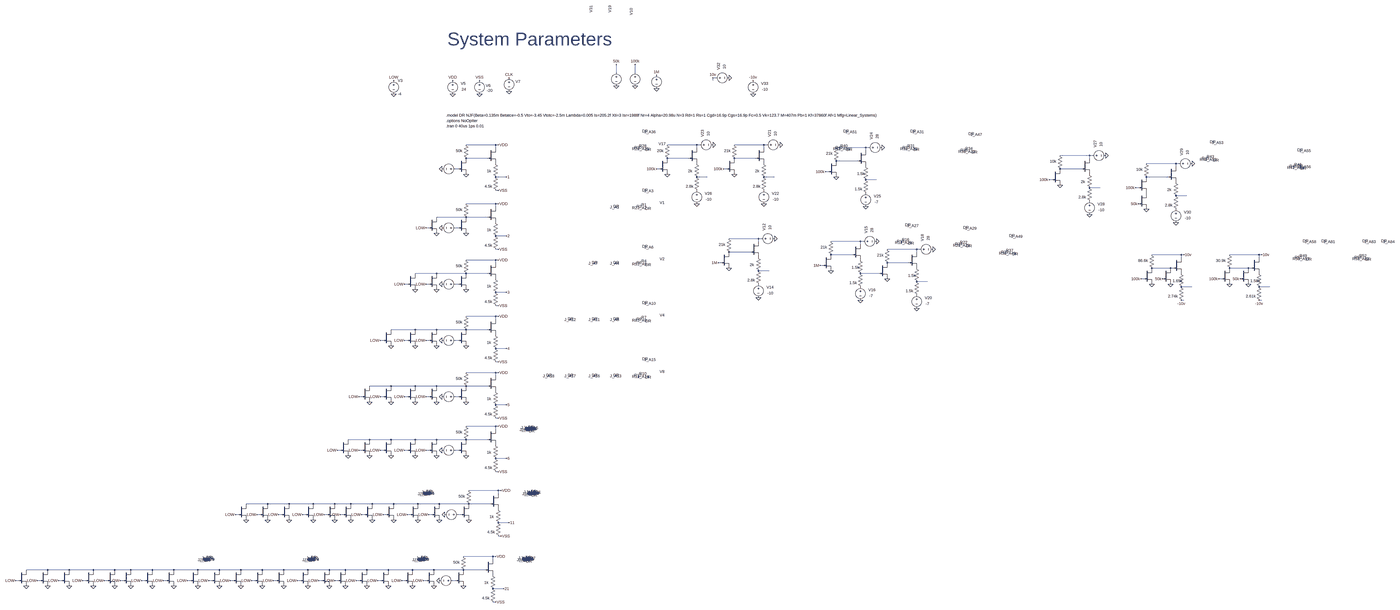
[diagram p0: schematic Multi-Or.asc, whole sheet]
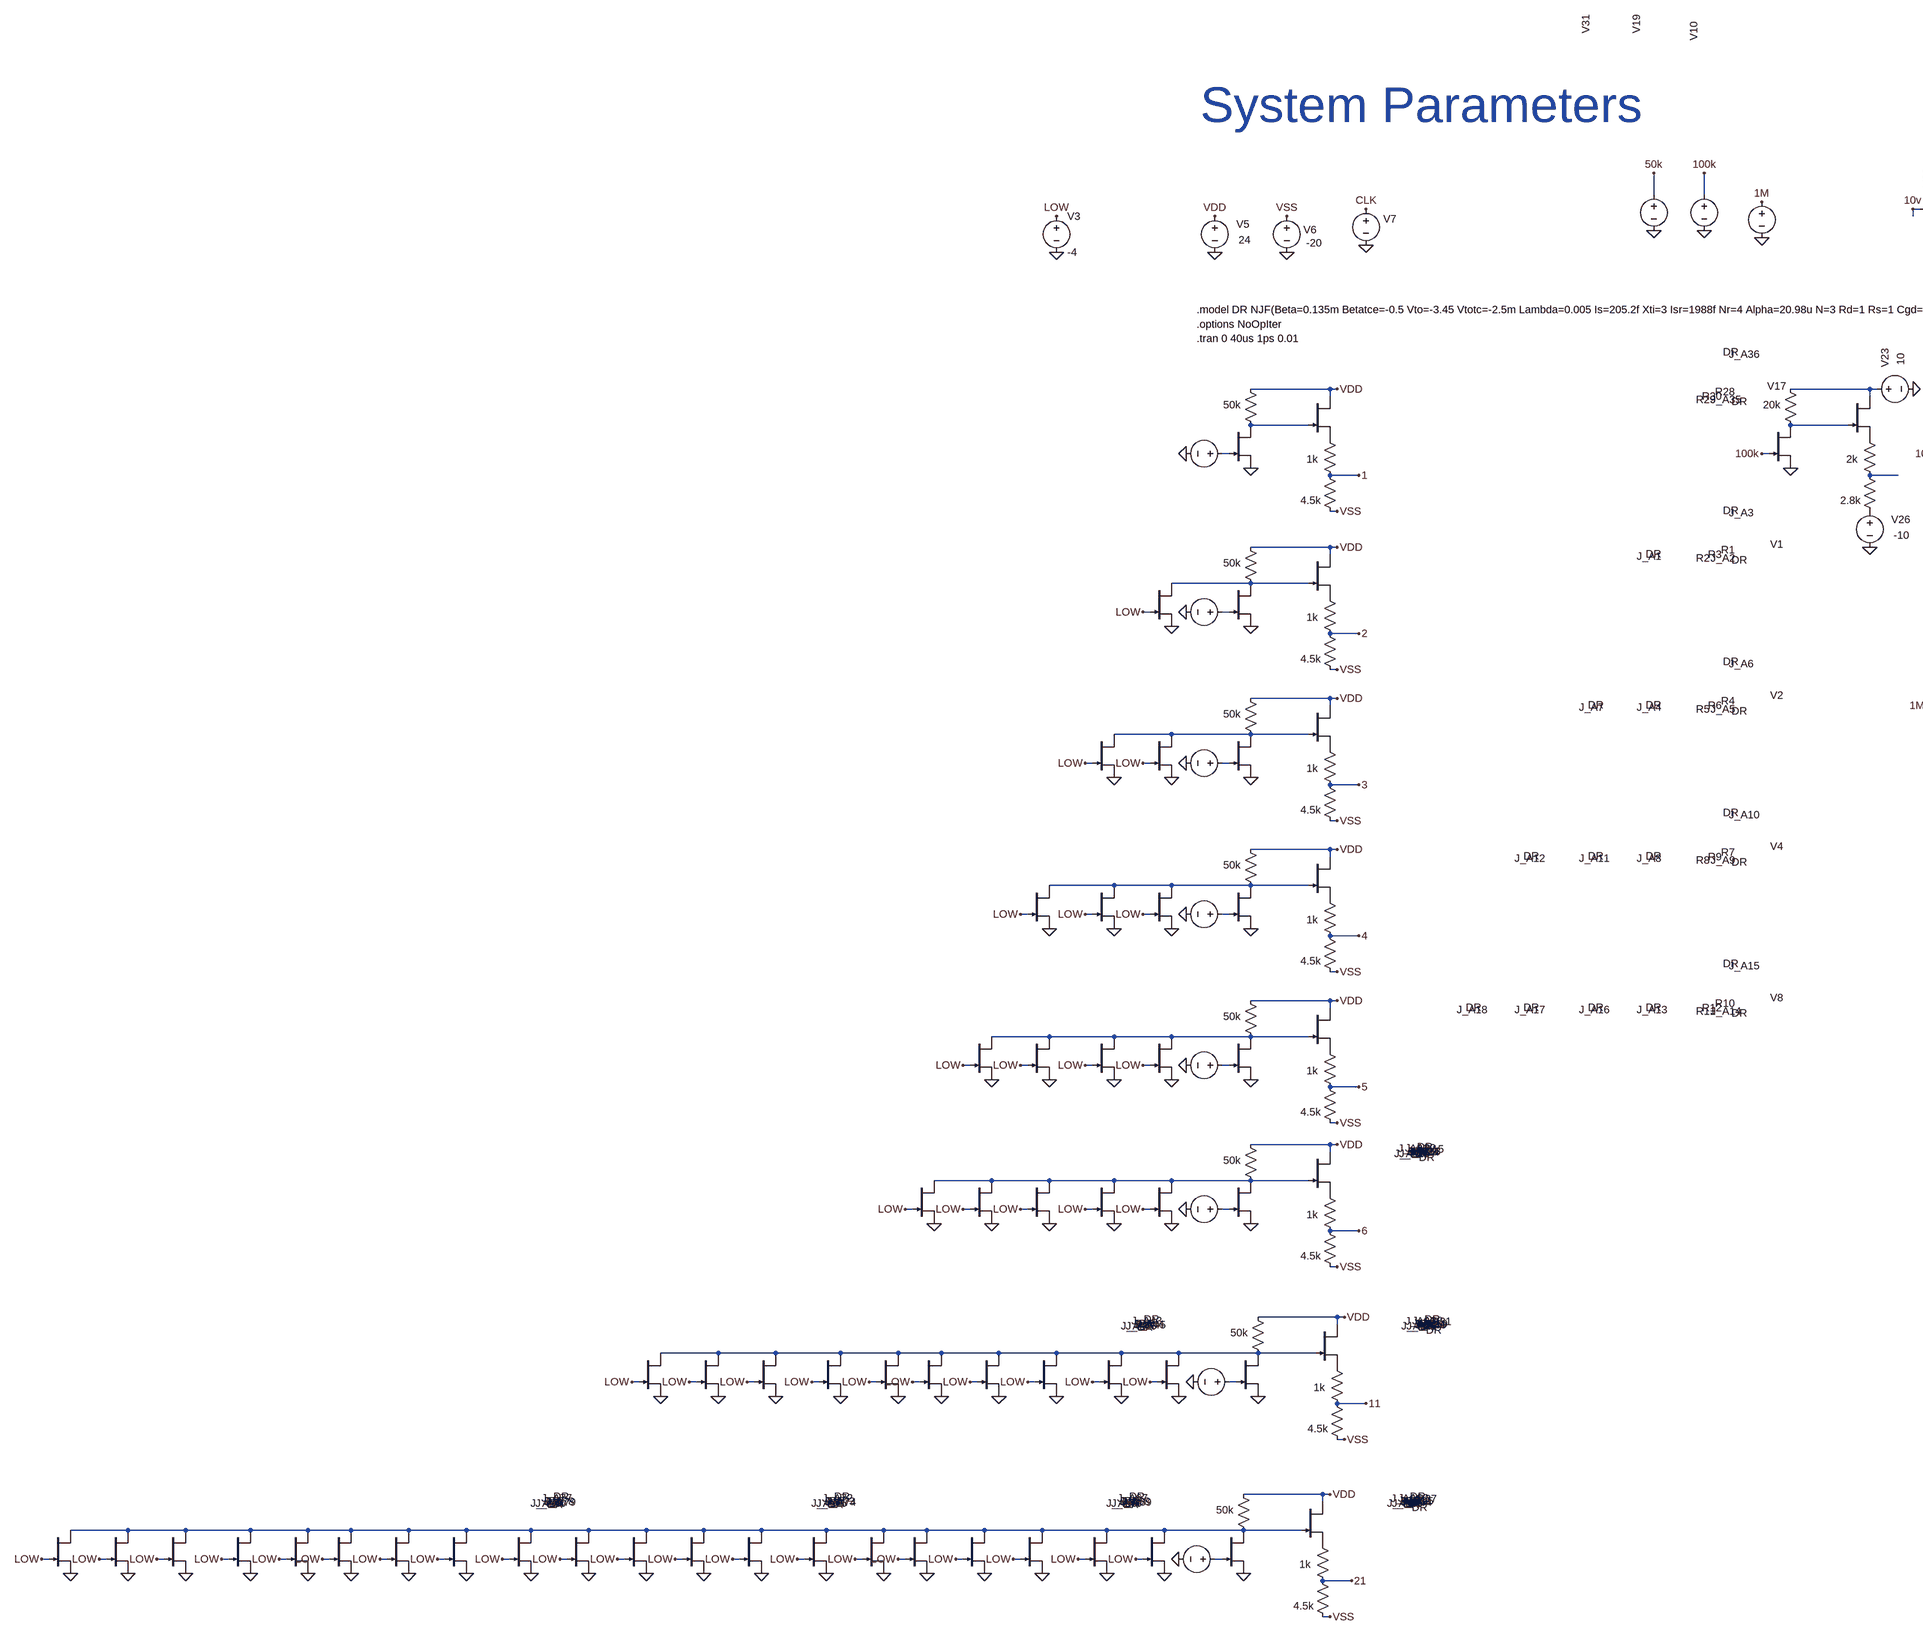
[diagram p1: schematic Multi-Or.asc, part, row 1 of 1, column 1 of 2]
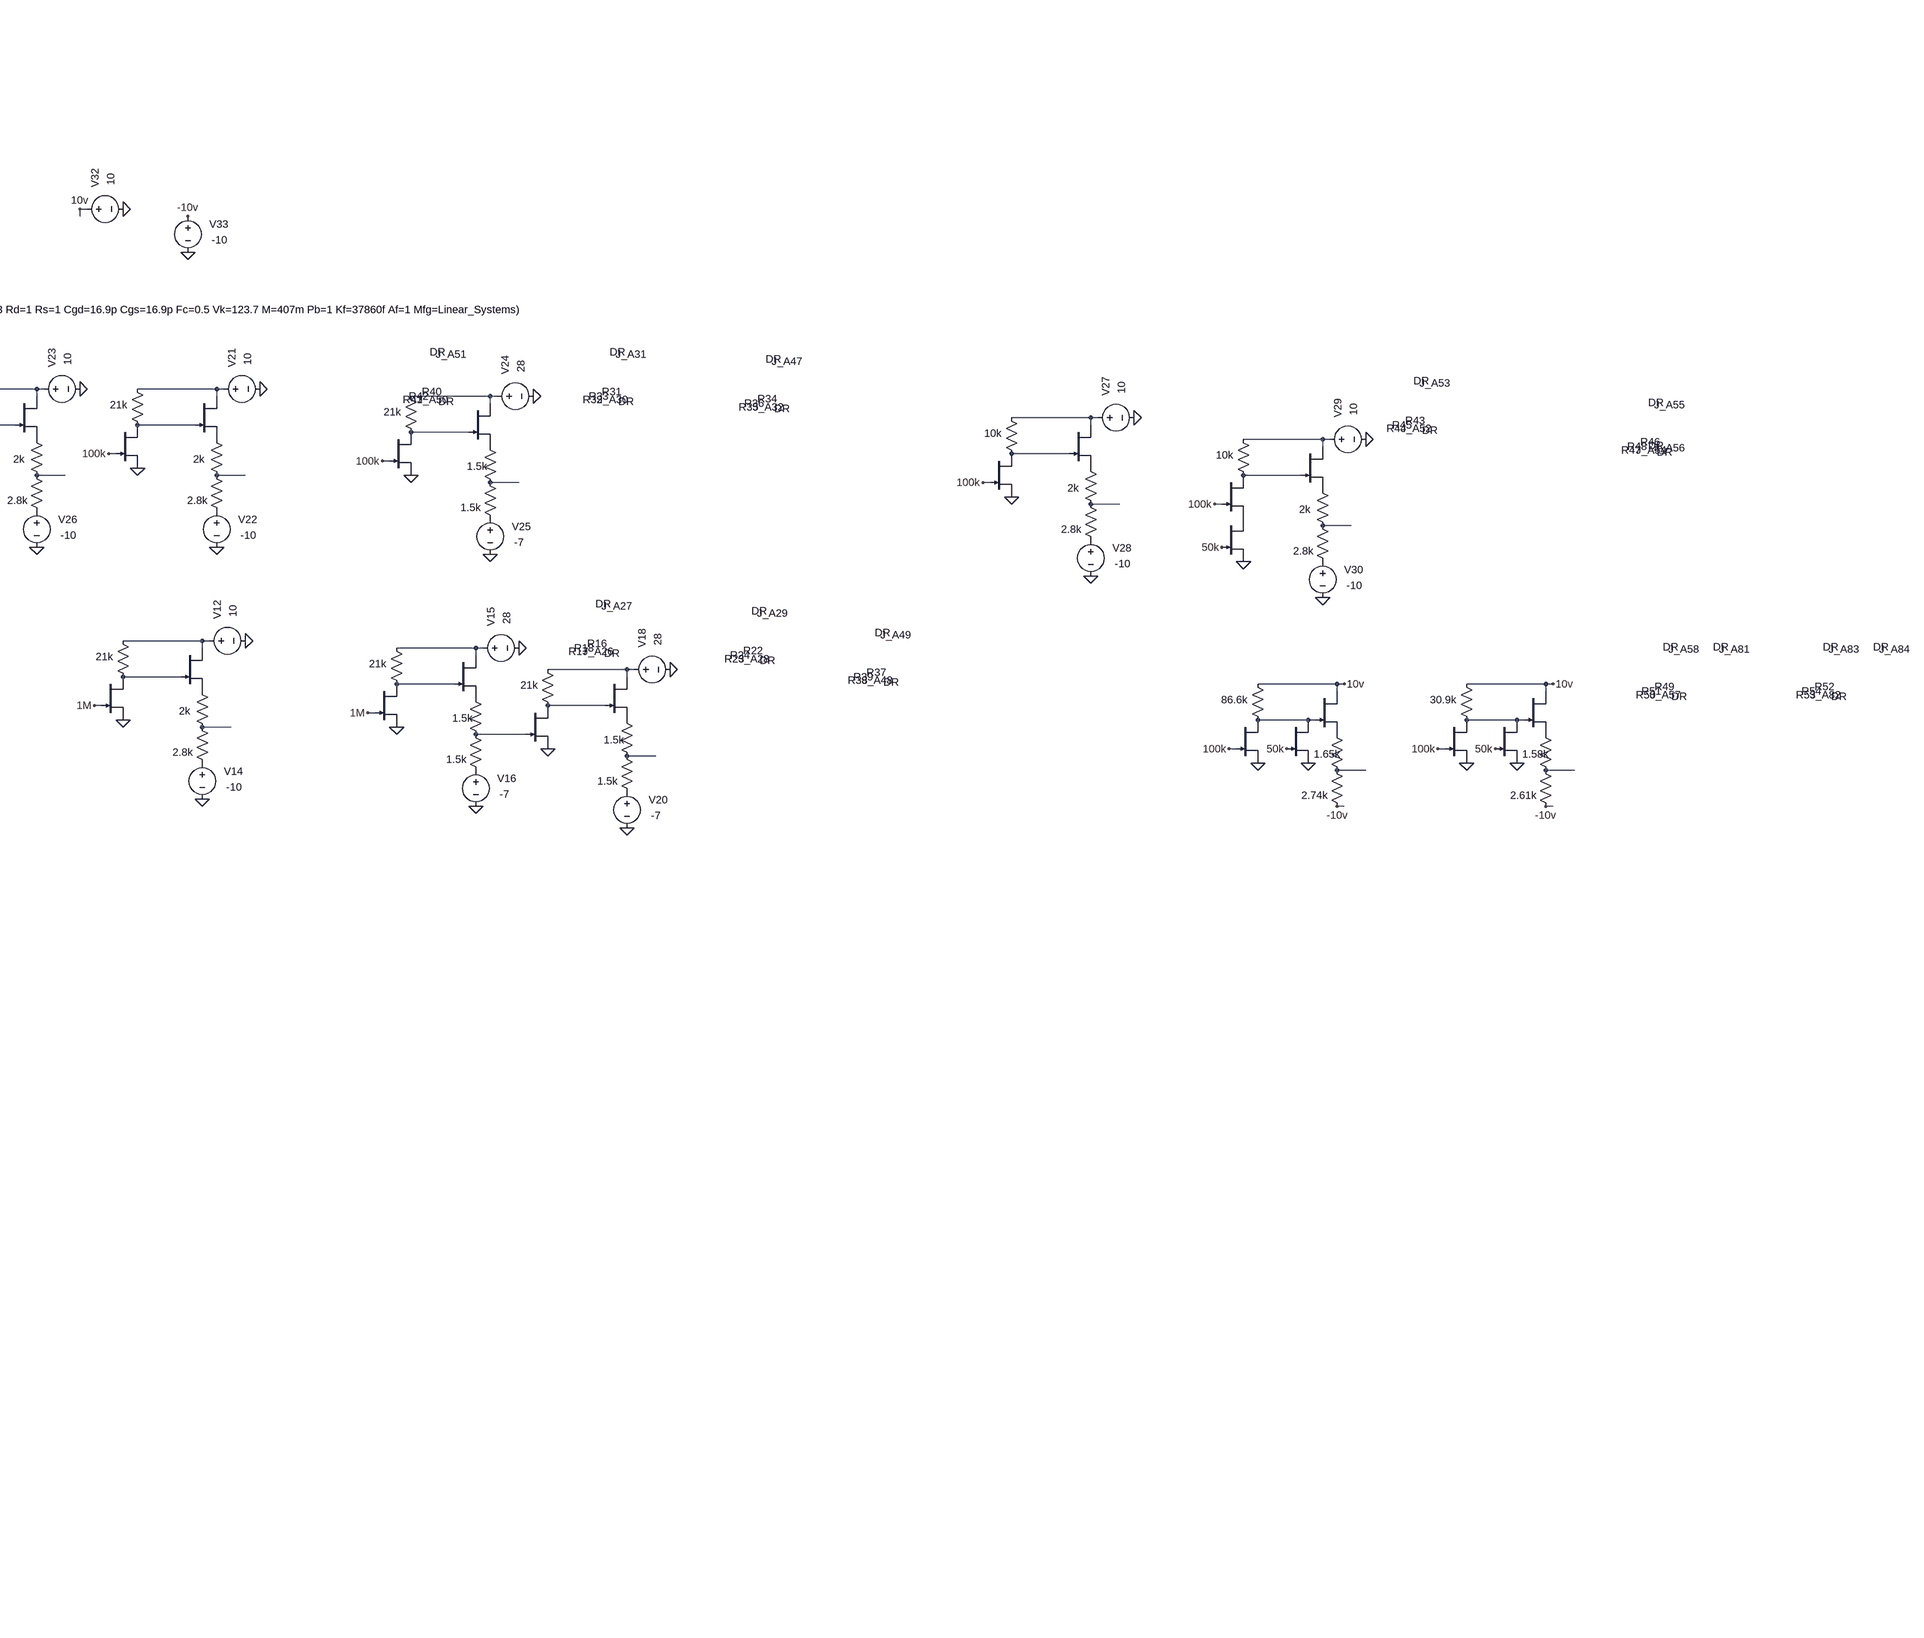
[diagram p2: schematic Multi-Or.asc, part, row 1 of 1, column 2 of 2]
Multi-Or.asc, the LTspice schematic file:
Version 4
SHEET 1 109444 42780
WIRE -5168 -6000 -5168 -6048
WIRE -5056 -6000 -5056 -6048
WIRE -4576 -5968 -4592 -5968
WIRE -4592 -5952 -4592 -5968
WIRE -5888 -5568 -6064 -5568
WIRE -5872 -5568 -5888 -5568
WIRE -4688 -5568 -4864 -5568
WIRE -4672 -5568 -4688 -5568
WIRE -4288 -5568 -4464 -5568
WIRE -4272 -5568 -4288 -5568
WIRE -5888 -5552 -5888 -5568
WIRE -4688 -5552 -4688 -5568
WIRE -4288 -5552 -4288 -5568
WIRE -3680 -5552 -3856 -5552
WIRE -3664 -5552 -3680 -5552
WIRE -3680 -5536 -3680 -5552
WIRE -2000 -5504 -2176 -5504
WIRE -1984 -5504 -2000 -5504
WIRE -5936 -5488 -6064 -5488
WIRE -4736 -5488 -4864 -5488
WIRE -4336 -5488 -4464 -5488
WIRE -2000 -5488 -2000 -5504
WIRE -3728 -5472 -3856 -5472
WIRE -1328 -5456 -1504 -5456
WIRE -1312 -5456 -1328 -5456
WIRE -1328 -5440 -1328 -5456
WIRE -6112 -5424 -6128 -5424
WIRE -4912 -5424 -4928 -5424
WIRE -4512 -5424 -4528 -5424
WIRE -2048 -5424 -2176 -5424
WIRE -3904 -5408 -3920 -5408
WIRE -5824 -5376 -5888 -5376
WIRE -4624 -5376 -4688 -5376
WIRE -4224 -5376 -4288 -5376
WIRE -1376 -5376 -1504 -5376
WIRE -3616 -5360 -3680 -5360
WIRE -2224 -5360 -2240 -5360
WIRE -1936 -5312 -2000 -5312
WIRE -1552 -5312 -1568 -5312
WIRE -5872 -5296 -5888 -5296
WIRE -1264 -5264 -1328 -5264
WIRE -5888 -5216 -6064 -5216
WIRE -5872 -5216 -5888 -5216
WIRE -5888 -5200 -5888 -5216
WIRE -6064 -5136 -6240 -5136
WIRE -5936 -5136 -6064 -5136
WIRE -6288 -5072 -6304 -5072
WIRE -6112 -5072 -6128 -5072
WIRE -5824 -5024 -5888 -5024
WIRE -4320 -5008 -4496 -5008
WIRE -4304 -5008 -4320 -5008
WIRE -4320 -4992 -4320 -5008
WIRE -3712 -4992 -3888 -4992
WIRE -3696 -4992 -3712 -4992
WIRE -3712 -4976 -3712 -4992
WIRE -5872 -4944 -5888 -4944
WIRE -3376 -4944 -3552 -4944
WIRE -3360 -4944 -3376 -4944
WIRE -4368 -4928 -4496 -4928
WIRE -3376 -4928 -3376 -4944
WIRE -3760 -4912 -3888 -4912
WIRE -1296 -4912 -1472 -4912
WIRE -1280 -4912 -1296 -4912
WIRE -832 -4912 -1008 -4912
WIRE -816 -4912 -832 -4912
WIRE -1296 -4896 -1296 -4912
WIRE -832 -4896 -832 -4912
WIRE -5888 -4880 -6064 -4880
WIRE -5872 -4880 -5888 -4880
WIRE -5888 -4864 -5888 -4880
WIRE -4544 -4864 -4560 -4864
WIRE -3424 -4864 -3552 -4864
WIRE -3936 -4848 -3952 -4848
WIRE -1360 -4832 -1472 -4832
WIRE -1344 -4832 -1360 -4832
WIRE -896 -4832 -1008 -4832
WIRE -880 -4832 -896 -4832
WIRE -4256 -4816 -4320 -4816
WIRE -6240 -4800 -6368 -4800
WIRE -6064 -4800 -6240 -4800
WIRE -5936 -4800 -6064 -4800
WIRE -3600 -4800 -3712 -4800
WIRE -1520 -4768 -1536 -4768
WIRE -1056 -4768 -1072 -4768
WIRE -3312 -4752 -3376 -4752
WIRE -6416 -4736 -6432 -4736
WIRE -6288 -4736 -6304 -4736
WIRE -6112 -4736 -6128 -4736
WIRE -1232 -4720 -1296 -4720
WIRE -768 -4720 -832 -4720
WIRE -5824 -4688 -5888 -4688
WIRE -1280 -4640 -1296 -4640
WIRE -816 -4640 -832 -4640
WIRE -5872 -4608 -5888 -4608
WIRE -5888 -4544 -6064 -4544
WIRE -5872 -4544 -5888 -4544
WIRE -5888 -4528 -5888 -4544
WIRE -6368 -4464 -6512 -4464
WIRE -6240 -4464 -6368 -4464
WIRE -6064 -4464 -6240 -4464
WIRE -5936 -4464 -6064 -4464
WIRE -6560 -4400 -6576 -4400
WIRE -6416 -4400 -6432 -4400
WIRE -6288 -4400 -6304 -4400
WIRE -6112 -4400 -6128 -4400
WIRE -5824 -4352 -5888 -4352
WIRE -5872 -4272 -5888 -4272
WIRE -5888 -4208 -6064 -4208
WIRE -5872 -4208 -5888 -4208
WIRE -5888 -4192 -5888 -4208
WIRE -6512 -4128 -6640 -4128
WIRE -6368 -4128 -6512 -4128
WIRE -6240 -4128 -6368 -4128
WIRE -6064 -4128 -6240 -4128
WIRE -5936 -4128 -6064 -4128
WIRE -6688 -4064 -6704 -4064
WIRE -6560 -4064 -6576 -4064
WIRE -6416 -4064 -6432 -4064
WIRE -6288 -4064 -6304 -4064
WIRE -6112 -4064 -6128 -4064
WIRE -5824 -4016 -5888 -4016
WIRE -5872 -3936 -5888 -3936
WIRE -5888 -3888 -6064 -3888
WIRE -5872 -3888 -5888 -3888
WIRE -5888 -3872 -5888 -3888
WIRE -6640 -3808 -6768 -3808
WIRE -6512 -3808 -6640 -3808
WIRE -6368 -3808 -6512 -3808
WIRE -6240 -3808 -6368 -3808
WIRE -6064 -3808 -6240 -3808
WIRE -5936 -3808 -6064 -3808
WIRE -6816 -3744 -6832 -3744
WIRE -6688 -3744 -6704 -3744
WIRE -6560 -3744 -6576 -3744
WIRE -6416 -3744 -6432 -3744
WIRE -6288 -3744 -6304 -3744
WIRE -6112 -3744 -6128 -3744
WIRE -5824 -3696 -5888 -3696
WIRE -5872 -3616 -5888 -3616
WIRE -5872 -3504 -6048 -3504
WIRE -5856 -3504 -5872 -3504
WIRE -5872 -3488 -5872 -3504
WIRE -7248 -3424 -7376 -3424
WIRE -7120 -3424 -7248 -3424
WIRE -6976 -3424 -7120 -3424
WIRE -6848 -3424 -6976 -3424
WIRE -6752 -3424 -6848 -3424
WIRE -6624 -3424 -6752 -3424
WIRE -6496 -3424 -6624 -3424
WIRE -6352 -3424 -6496 -3424
WIRE -6224 -3424 -6352 -3424
WIRE -6048 -3424 -6224 -3424
WIRE -5920 -3424 -6048 -3424
WIRE -7424 -3360 -7440 -3360
WIRE -7296 -3360 -7312 -3360
WIRE -7168 -3360 -7184 -3360
WIRE -7024 -3360 -7040 -3360
WIRE -6896 -3360 -6912 -3360
WIRE -6800 -3360 -6816 -3360
WIRE -6672 -3360 -6688 -3360
WIRE -6544 -3360 -6560 -3360
WIRE -6400 -3360 -6416 -3360
WIRE -6272 -3360 -6288 -3360
WIRE -6096 -3360 -6112 -3360
WIRE -5808 -3312 -5872 -3312
WIRE -5856 -3232 -5872 -3232
WIRE -5904 -3040 -6080 -3040
WIRE -5888 -3040 -5904 -3040
WIRE -5904 -3024 -5904 -3040
WIRE -8560 -2960 -8688 -2960
WIRE -8432 -2960 -8560 -2960
WIRE -8288 -2960 -8432 -2960
WIRE -8160 -2960 -8288 -2960
WIRE -8064 -2960 -8160 -2960
WIRE -7936 -2960 -8064 -2960
WIRE -7808 -2960 -7936 -2960
WIRE -7664 -2960 -7808 -2960
WIRE -7536 -2960 -7664 -2960
WIRE -7408 -2960 -7536 -2960
WIRE -7280 -2960 -7408 -2960
WIRE -7152 -2960 -7280 -2960
WIRE -7008 -2960 -7152 -2960
WIRE -6880 -2960 -7008 -2960
WIRE -6784 -2960 -6880 -2960
WIRE -6656 -2960 -6784 -2960
WIRE -6528 -2960 -6656 -2960
WIRE -6384 -2960 -6528 -2960
WIRE -6256 -2960 -6384 -2960
WIRE -6080 -2960 -6256 -2960
WIRE -5952 -2960 -6080 -2960
WIRE -8736 -2896 -8752 -2896
WIRE -8608 -2896 -8624 -2896
WIRE -8480 -2896 -8496 -2896
WIRE -8336 -2896 -8352 -2896
WIRE -8208 -2896 -8224 -2896
WIRE -8112 -2896 -8128 -2896
WIRE -7984 -2896 -8000 -2896
WIRE -7856 -2896 -7872 -2896
WIRE -7712 -2896 -7728 -2896
WIRE -7584 -2896 -7600 -2896
WIRE -7456 -2896 -7472 -2896
WIRE -7328 -2896 -7344 -2896
WIRE -7200 -2896 -7216 -2896
WIRE -7056 -2896 -7072 -2896
WIRE -6928 -2896 -6944 -2896
WIRE -6832 -2896 -6848 -2896
WIRE -6704 -2896 -6720 -2896
WIRE -6576 -2896 -6592 -2896
WIRE -6432 -2896 -6448 -2896
WIRE -6304 -2896 -6320 -2896
WIRE -6128 -2896 -6144 -2896
WIRE -5840 -2848 -5904 -2848
WIRE -5888 -2768 -5904 -2768
FLAG -5984 -5872 0
FLAG -6144 -5952 VDD
FLAG -6144 -5872 0
FLAG -5984 -5952 VSS
FLAG -6208 -5424 0
FLAG -6064 -5392 0
FLAG -5872 -5568 VDD
FLAG -5872 -5296 VSS
FLAG -5808 -5888 0
FLAG -5808 -5968 CLK
FLAG -5824 -5376 1
FLAG -6208 -5072 0
FLAG -6064 -5040 0
FLAG -5872 -5216 VDD
FLAG -5872 -4944 VSS
FLAG -6240 -5040 0
FLAG -5824 -5024 2
FLAG -6496 -5872 0
FLAG -6496 -5952 LOW
FLAG -6304 -5072 LOW
FLAG -6208 -4736 0
FLAG -6064 -4704 0
FLAG -5872 -4880 VDD
FLAG -5872 -4608 VSS
FLAG -6240 -4704 0
FLAG -5824 -4688 3
FLAG -6304 -4736 LOW
FLAG -6368 -4704 0
FLAG -6432 -4736 LOW
FLAG -6208 -4400 0
FLAG -6064 -4368 0
FLAG -5872 -4544 VDD
FLAG -5872 -4272 VSS
FLAG -6240 -4368 0
FLAG -5824 -4352 4
FLAG -6304 -4400 LOW
FLAG -6368 -4368 0
FLAG -6432 -4400 LOW
FLAG -6512 -4368 0
FLAG -6576 -4400 LOW
FLAG -6208 -4064 0
FLAG -6064 -4032 0
FLAG -5872 -4208 VDD
FLAG -5872 -3936 VSS
FLAG -6240 -4032 0
FLAG -5824 -4016 5
FLAG -6304 -4064 LOW
FLAG -6368 -4032 0
FLAG -6432 -4064 LOW
FLAG -6512 -4032 0
FLAG -6576 -4064 LOW
FLAG -6640 -4032 0
FLAG -6704 -4064 LOW
FLAG -6208 -3744 0
FLAG -6064 -3712 0
FLAG -5872 -3888 VDD
FLAG -5872 -3616 VSS
FLAG -6240 -3712 0
FLAG -5824 -3696 6
FLAG -6304 -3744 LOW
FLAG -6368 -3712 0
FLAG -6432 -3744 LOW
FLAG -6512 -3712 0
FLAG -6576 -3744 LOW
FLAG -6640 -3712 0
FLAG -6704 -3744 LOW
FLAG -6768 -3712 0
FLAG -6832 -3744 LOW
FLAG -6192 -3360 0
FLAG -6048 -3328 0
FLAG -5856 -3504 VDD
FLAG -5856 -3232 VSS
FLAG -6224 -3328 0
FLAG -5808 -3312 11
FLAG -6288 -3360 LOW
FLAG -6352 -3328 0
FLAG -6416 -3360 LOW
FLAG -6496 -3328 0
FLAG -6560 -3360 LOW
FLAG -6624 -3328 0
FLAG -6688 -3360 LOW
FLAG -6752 -3328 0
FLAG -6848 -3328 0
FLAG -6912 -3360 LOW
FLAG -6976 -3328 0
FLAG -7040 -3360 LOW
FLAG -7120 -3328 0
FLAG -7184 -3360 LOW
FLAG -7248 -3328 0
FLAG -7312 -3360 LOW
FLAG -7376 -3328 0
FLAG -7440 -3360 LOW
FLAG -6816 -3360 LOW
FLAG -6224 -2896 0
FLAG -6080 -2864 0
FLAG -5888 -3040 VDD
FLAG -5888 -2768 VSS
FLAG -6256 -2864 0
FLAG -5840 -2848 21
FLAG -6320 -2896 LOW
FLAG -6384 -2864 0
FLAG -6448 -2896 LOW
FLAG -6528 -2864 0
FLAG -6592 -2896 LOW
FLAG -6656 -2864 0
FLAG -6720 -2896 LOW
FLAG -6784 -2864 0
FLAG -6880 -2864 0
FLAG -6944 -2896 LOW
FLAG -7008 -2864 0
FLAG -7072 -2896 LOW
FLAG -7152 -2864 0
FLAG -7216 -2896 LOW
FLAG -7280 -2864 0
FLAG -7344 -2896 LOW
FLAG -7408 -2864 0
FLAG -7472 -2896 LOW
FLAG -6848 -2896 LOW
FLAG -7536 -2864 0
FLAG -7600 -2896 LOW
FLAG -7664 -2864 0
FLAG -7728 -2896 LOW
FLAG -7808 -2864 0
FLAG -7872 -2896 LOW
FLAG -7936 -2864 0
FLAG -8000 -2896 LOW
FLAG -8064 -2864 0
FLAG -8160 -2864 0
FLAG -8224 -2896 LOW
FLAG -8288 -2864 0
FLAG -8352 -2896 LOW
FLAG -8432 -2864 0
FLAG -8496 -2896 LOW
FLAG -8560 -2864 0
FLAG -8624 -2896 LOW
FLAG -8688 -2864 0
FLAG -8752 -2896 LOW
FLAG -8128 -2896 LOW
FLAG -5056 -5920 0
FLAG -5056 -6048 100k
FLAG -4464 -5392 0
FLAG -4192 -5568 0
FLAG -4288 -5216 0
FLAG -3856 -5376 0
FLAG -3584 -5552 0
FLAG -3680 -5200 0
FLAG -4528 -5424 100k
FLAG -3920 -5408 100k
FLAG -4928 -5904 0
FLAG -4928 -5984 1M
FLAG -4496 -4832 0
FLAG -4224 -5008 0
FLAG -4320 -4656 0
FLAG -3888 -4816 0
FLAG -3616 -4992 0
FLAG -3712 -4640 0
FLAG -4560 -4864 1M
FLAG -3952 -4848 1M
FLAG -3552 -4768 0
FLAG -3280 -4944 0
FLAG -3376 -4592 0
FLAG -4864 -5392 0
FLAG -4592 -5568 0
FLAG -4688 -5216 0
FLAG -4928 -5424 100k
FLAG -2176 -5328 0
FLAG -1904 -5504 0
FLAG -2000 -5152 0
FLAG -2240 -5360 100k
FLAG -1232 -5456 0
FLAG -1328 -5104 0
FLAG -1568 -5312 100k
FLAG -1504 -5184 0
FLAG -5168 -6048 50k
FLAG -5168 -5920 0
FLAG -1552 -5216 50k
FLAG -1360 -4736 0
FLAG -1536 -4768 100k
FLAG -1408 -4768 50k
FLAG -1472 -4736 0
FLAG -896 -4736 0
FLAG -1072 -4768 100k
FLAG -944 -4768 50k
FLAG -1008 -4736 0
FLAG -4496 -5968 0
FLAG -4352 -5872 0
FLAG -4592 -5968 10v
FLAG -4352 -5952 -10v
FLAG -1296 -4640 -10v
FLAG -832 -4640 -10v
FLAG -816 -4912 10v
FLAG -1280 -4912 10v
SYMBOL voltage -6144 -5968 R0
WINDOW 0 48 34 Left 2
WINDOW 3 53 69 Left 2
WINDOW 123 0 0 Left 0
WINDOW 39 0 0 Left 0
SYMATTR InstName V5
SYMATTR Value 24
SYMBOL voltage -5984 -5968 R0
WINDOW 123 0 0 Left 0
WINDOW 39 0 0 Left 0
WINDOW 0 37 46 Left 2
WINDOW 3 43 75 Left 2
SYMATTR InstName V6
SYMATTR Value -20
SYMBOL voltage -6112 -5424 R90
WINDOW 0 -135 -1217 VBottom 2
WINDOW 3 222 45 Invisible 2
WINDOW 123 0 0 Left 0
WINDOW 39 0 0 Left 0
SYMATTR InstName V17
SYMATTR Value PULSE(-4 0 10u 0.1u 0.1u 5u 10u 2)
SYMBOL res -6048 -5472 R180
WINDOW 0 -1060 90 Left 2
WINDOW 3 38 61 Left 2
SYMATTR InstName R28
SYMATTR Value 50k
SYMBOL njf -5936 -5552 R0
WINDOW 0 894 8 Left 2
WINDOW 3 941 12 Left 2
SYMATTR InstName J_A35
SYMATTR Value DR
SYMBOL res -5904 -5472 R0
WINDOW 0 830 -72 Left 2
WINDOW 3 -36 60 Left 2
SYMATTR InstName R29
SYMATTR Value 1k
SYMBOL res -5872 -5280 R180
WINDOW 0 -855 272 Left 2
WINDOW 3 36 40 Left 2
SYMATTR InstName R30
SYMATTR Value 4.5k
SYMBOL njf -6112 -5488 R0
WINDOW 0 1111 -157 Left 2
WINDOW 3 1098 -162 Left 2
SYMATTR InstName J_A36
SYMATTR Value DR
SYMBOL voltage -5808 -5984 R0
WINDOW 123 0 0 Left 0
WINDOW 39 0 0 Left 0
WINDOW 0 39 38 Left 2
WINDOW 3 43 75 Invisible 2
SYMATTR InstName V7
SYMATTR Value PULSE(-3.6 -800m 10u 1ns 1ns 5.15us 10us 10000000000000)
SYMBOL voltage -6112 -5072 R90
WINDOW 0 -135 -1217 VBottom 2
WINDOW 3 222 45 Invisible 2
WINDOW 123 0 0 Left 0
WINDOW 39 0 0 Left 0
SYMATTR InstName V1
SYMATTR Value PULSE(-4 0 10u 0.1u 0.1u 5u 10u 2)
SYMBOL njf -6288 -5136 R0
WINDOW 0 1082 -60 Left 2
WINDOW 3 1102 -65 Left 2
SYMATTR InstName J_A1
SYMATTR Value DR
SYMBOL res -6048 -5120 R180
WINDOW 0 -1060 90 Left 2
WINDOW 3 38 61 Left 2
SYMATTR InstName R1
SYMATTR Value 50k
SYMBOL njf -5936 -5200 R0
WINDOW 0 894 8 Left 2
WINDOW 3 941 12 Left 2
SYMATTR InstName J_A2
SYMATTR Value DR
SYMBOL res -5904 -5120 R0
WINDOW 0 830 -72 Left 2
WINDOW 3 -36 60 Left 2
SYMATTR InstName R2
SYMATTR Value 1k
SYMBOL res -5872 -4928 R180
WINDOW 0 -855 272 Left 2
WINDOW 3 36 40 Left 2
SYMATTR InstName R3
SYMATTR Value 4.5k
SYMBOL njf -6112 -5136 R0
WINDOW 0 1111 -157 Left 2
WINDOW 3 1098 -162 Left 2
SYMATTR InstName J_A3
SYMATTR Value DR
SYMBOL voltage -6496 -5968 R0
WINDOW 123 0 0 Left 0
WINDOW 39 0 0 Left 0
SYMATTR InstName V3
SYMATTR Value -4
SYMBOL voltage -6112 -4736 R90
WINDOW 0 -135 -1217 VBottom 2
WINDOW 3 222 45 Invisible 2
WINDOW 123 0 0 Left 0
WINDOW 39 0 0 Left 0
SYMATTR InstName V2
SYMATTR Value PULSE(-4 0 10u 0.1u 0.1u 5u 10u 2)
SYMBOL njf -6288 -4800 R0
WINDOW 0 1082 -60 Left 2
WINDOW 3 1102 -65 Left 2
SYMATTR InstName J_A4
SYMATTR Value DR
SYMBOL res -6048 -4784 R180
WINDOW 0 -1060 90 Left 2
WINDOW 3 38 61 Left 2
SYMATTR InstName R4
SYMATTR Value 50k
SYMBOL njf -5936 -4864 R0
WINDOW 0 894 8 Left 2
WINDOW 3 941 12 Left 2
SYMATTR InstName J_A5
SYMATTR Value DR
SYMBOL res -5904 -4784 R0
WINDOW 0 830 -72 Left 2
WINDOW 3 -36 60 Left 2
SYMATTR InstName R5
SYMATTR Value 1k
SYMBOL res -5872 -4592 R180
WINDOW 0 -855 272 Left 2
WINDOW 3 36 40 Left 2
SYMATTR InstName R6
SYMATTR Value 4.5k
SYMBOL njf -6112 -4800 R0
WINDOW 0 1111 -157 Left 2
WINDOW 3 1098 -162 Left 2
SYMATTR InstName J_A6
SYMATTR Value DR
SYMBOL njf -6416 -4800 R0
WINDOW 0 1082 -60 Left 2
WINDOW 3 1102 -65 Left 2
SYMATTR InstName J_A7
SYMATTR Value DR
SYMBOL voltage -6112 -4400 R90
WINDOW 0 -135 -1217 VBottom 2
WINDOW 3 222 45 Invisible 2
WINDOW 123 0 0 Left 0
WINDOW 39 0 0 Left 0
SYMATTR InstName V4
SYMATTR Value PULSE(-4 0 10u 0.1u 0.1u 5u 10u 2)
SYMBOL njf -6288 -4464 R0
WINDOW 0 1082 -60 Left 2
WINDOW 3 1102 -65 Left 2
SYMATTR InstName J_A8
SYMATTR Value DR
SYMBOL res -6048 -4448 R180
WINDOW 0 -1060 90 Left 2
WINDOW 3 38 61 Left 2
SYMATTR InstName R7
SYMATTR Value 50k
SYMBOL njf -5936 -4528 R0
WINDOW 0 894 8 Left 2
WINDOW 3 941 12 Left 2
SYMATTR InstName J_A9
SYMATTR Value DR
SYMBOL res -5904 -4448 R0
WINDOW 0 830 -72 Left 2
WINDOW 3 -36 60 Left 2
SYMATTR InstName R8
SYMATTR Value 1k
SYMBOL res -5872 -4256 R180
WINDOW 0 -855 272 Left 2
WINDOW 3 36 40 Left 2
SYMATTR InstName R9
SYMATTR Value 4.5k
SYMBOL njf -6112 -4464 R0
WINDOW 0 1111 -157 Left 2
WINDOW 3 1098 -162 Left 2
SYMATTR InstName J_A10
SYMATTR Value DR
SYMBOL njf -6416 -4464 R0
WINDOW 0 1082 -60 Left 2
WINDOW 3 1102 -65 Left 2
SYMATTR InstName J_A11
SYMATTR Value DR
SYMBOL njf -6560 -4464 R0
WINDOW 0 1082 -60 Left 2
WINDOW 3 1102 -65 Left 2
SYMATTR InstName J_A12
SYMATTR Value DR
SYMBOL voltage -6112 -4064 R90
WINDOW 0 -135 -1217 VBottom 2
WINDOW 3 222 45 Invisible 2
WINDOW 123 0 0 Left 0
WINDOW 39 0 0 Left 0
SYMATTR InstName V8
SYMATTR Value PULSE(-4 0 10u 0.1u 0.1u 5u 10u 2)
SYMBOL njf -6288 -4128 R0
WINDOW 0 1082 -60 Left 2
WINDOW 3 1102 -65 Left 2
SYMATTR InstName J_A13
SYMATTR Value DR
SYMBOL res -6048 -4112 R180
WINDOW 0 -1060 90 Left 2
WINDOW 3 38 61 Left 2
SYMATTR InstName R10
SYMATTR Value 50k
SYMBOL njf -5936 -4192 R0
WINDOW 0 894 8 Left 2
WINDOW 3 941 12 Left 2
SYMATTR InstName J_A14
SYMATTR Value DR
SYMBOL res -5904 -4112 R0
WINDOW 0 830 -72 Left 2
WINDOW 3 -36 60 Left 2
SYMATTR InstName R11
SYMATTR Value 1k
SYMBOL res -5872 -3920 R180
WINDOW 0 -855 272 Left 2
WINDOW 3 36 40 Left 2
SYMATTR InstName R12
SYMATTR Value 4.5k
SYMBOL njf -6112 -4128 R0
WINDOW 0 1111 -157 Left 2
WINDOW 3 1098 -162 Left 2
SYMATTR InstName J_A15
SYMATTR Value DR
SYMBOL njf -6416 -4128 R0
WINDOW 0 1082 -60 Left 2
WINDOW 3 1102 -65 Left 2
SYMATTR InstName J_A16
SYMATTR Value DR
SYMBOL njf -6560 -4128 R0
WINDOW 0 1082 -60 Left 2
WINDOW 3 1102 -65 Left 2
SYMATTR InstName J_A17
SYMATTR Value DR
SYMBOL njf -6688 -4128 R0
WINDOW 0 1082 -60 Left 2
WINDOW 3 1102 -65 Left 2
SYMATTR InstName J_A18
SYMATTR Value DR
SYMBOL voltage -6112 -3744 R90
WINDOW 0 -115 -418 VBottom 2
WINDOW 3 222 45 Invisible 2
WINDOW 123 0 0 Left 0
WINDOW 39 0 0 Left 0
SYMATTR InstName V9
SYMATTR Value PULSE(-4 0 10u 0.1u 0.1u 5u 10u 2)
SYMBOL njf -6288 -3808 R0
WINDOW 0 543 -60 Left 2
WINDOW 3 594 -75 Left 2
SYMATTR InstName J_A19
SYMATTR Value DR
SYMBOL res -6048 -3792 R180
WINDOW 0 -406 81 Left 2
WINDOW 3 38 61 Left 2
SYMATTR InstName R13
SYMATTR Value 50k
SYMBOL njf -5936 -3872 R0
WINDOW 0 221 0 Left 2
WINDOW 3 246 13 Left 2
SYMATTR InstName J_A20
SYMATTR Value DR
SYMBOL res -5904 -3792 R0
WINDOW 0 194 -77 Left 2
WINDOW 3 -36 60 Left 2
SYMATTR InstName R14
SYMATTR Value 1k
SYMBOL res -5872 -3600 R180
WINDOW 0 -238 278 Left 2
WINDOW 3 36 40 Left 2
SYMATTR InstName R15
SYMATTR Value 4.5k
SYMBOL njf -6112 -3808 R0
WINDOW 0 375 -71 Left 2
WINDOW 3 416 -63 Left 2
SYMATTR InstName J_A21
SYMATTR Value DR
SYMBOL njf -6416 -3808 R0
WINDOW 0 695 -72 Left 2
WINDOW 3 712 -60 Left 2
SYMATTR InstName J_A22
SYMATTR Value DR
SYMBOL njf -6560 -3808 R0
WINDOW 0 844 -64 Left 2
WINDOW 3 852 -58 Left 2
SYMATTR InstName J_A23
SYMATTR Value DR
SYMBOL njf -6688 -3808 R0
WINDOW 0 975 -63 Left 2
WINDOW 3 983 -65 Left 2
SYMATTR InstName J_A24
SYMATTR Value DR
SYMBOL njf -6816 -3808 R0
WINDOW 0 1082 -60 Left 2
WINDOW 3 1102 -65 Left 2
SYMATTR InstName J_A25
SYMATTR Value DR
SYMBOL voltage -6096 -3360 R90
WINDOW 0 -115 -418 VBottom 2
WINDOW 3 222 45 Invisible 2
WINDOW 123 0 0 Left 0
WINDOW 39 0 0 Left 0
SYMATTR InstName V11
SYMATTR Value PULSE(-4 0 10u 0.1u 0.1u 5u 10u 2)
SYMBOL njf -6272 -3424 R0
WINDOW 0 543 -60 Left 2
WINDOW 3 594 -75 Left 2
SYMATTR InstName J_A33
SYMATTR Value DR
SYMBOL res -6032 -3408 R180
WINDOW 0 -406 81 Left 2
WINDOW 3 38 61 Left 2
SYMATTR InstName R19
SYMATTR Value 50k
SYMBOL njf -5920 -3488 R0
WINDOW 0 221 0 Left 2
WINDOW 3 246 13 Left 2
SYMATTR InstName J_A34
SYMATTR Value DR
SYMBOL res -5888 -3408 R0
WINDOW 0 194 -77 Left 2
WINDOW 3 -36 60 Left 2
SYMATTR InstName R20
SYMATTR Value 1k
SYMBOL res -5856 -3216 R180
WINDOW 0 -238 278 Left 2
WINDOW 3 36 40 Left 2
SYMATTR InstName R21
SYMATTR Value 4.5k
SYMBOL njf -6096 -3424 R0
WINDOW 0 375 -71 Left 2
WINDOW 3 416 -63 Left 2
SYMATTR InstName J_A37
SYMATTR Value DR
SYMBOL njf -6400 -3424 R0
WINDOW 0 695 -72 Left 2
WINDOW 3 712 -60 Left 2
SYMATTR InstName J_A38
SYMATTR Value DR
SYMBOL njf -6544 -3424 R0
WINDOW 0 844 -64 Left 2
WINDOW 3 852 -58 Left 2
SYMATTR InstName J_A39
SYMATTR Value DR
SYMBOL njf -6672 -3424 R0
WINDOW 0 975 -63 Left 2
WINDOW 3 983 -65 Left 2
SYMATTR InstName J_A40
SYMATTR Value DR
SYMBOL njf -6800 -3424 R0
WINDOW 0 1082 -60 Left 2
WINDOW 3 1102 -65 Left 2
SYMATTR InstName J_A41
SYMATTR Value DR
SYMBOL njf -6896 -3424 R0
WINDOW 0 543 -60 Left 2
WINDOW 3 594 -75 Left 2
SYMATTR InstName J_A42
SYMATTR Value DR
SYMBOL njf -7024 -3424 R0
WINDOW 0 695 -72 Left 2
WINDOW 3 712 -60 Left 2
SYMATTR InstName J_A43
SYMATTR Value DR
SYMBOL njf -7168 -3424 R0
WINDOW 0 844 -64 Left 2
WINDOW 3 852 -58 Left 2
SYMATTR InstName J_A44
SYMATTR Value DR
SYMBOL njf -7296 -3424 R0
WINDOW 0 975 -63 Left 2
WINDOW 3 983 -65 Left 2
SYMATTR InstName J_A45
SYMATTR Value DR
SYMBOL njf -7424 -3424 R0
WINDOW 0 1082 -60 Left 2
WINDOW 3 1102 -65 Left 2
SYMATTR InstName J_A46
SYMATTR Value DR
SYMBOL voltage -6128 -2896 R90
WINDOW 0 -115 -418 VBottom 2
WINDOW 3 222 45 Invisible 2
WINDOW 123 0 0 Left 0
WINDOW 39 0 0 Left 0
SYMATTR InstName V13
SYMATTR Value PULSE(-4 0 10u 0.1u 0.1u 5u 10u 2)
SYMBOL njf -6304 -2960 R0
WINDOW 0 543 -60 Left 2
WINDOW 3 594 -75 Left 2
SYMATTR InstName J_A59
SYMATTR Value DR
SYMBOL res -6064 -2944 R180
WINDOW 0 -406 81 Left 2
WINDOW 3 38 61 Left 2
SYMATTR InstName R25
SYMATTR Value 50k
SYMBOL njf -5952 -3024 R0
WINDOW 0 221 0 Left 2
WINDOW 3 246 13 Left 2
SYMATTR InstName J_A60
SYMATTR Value DR
SYMBOL res -5920 -2944 R0
WINDOW 0 194 -77 Left 2
WINDOW 3 -36 60 Left 2
SYMATTR InstName R26
SYMATTR Value 1k
SYMBOL res -5888 -2752 R180
WINDOW 0 -238 278 Left 2
WINDOW 3 36 40 Left 2
SYMATTR InstName R27
SYMATTR Value 4.5k
SYMBOL njf -6128 -2960 R0
WINDOW 0 375 -71 Left 2
WINDOW 3 416 -63 Left 2
SYMATTR InstName J_A61
SYMATTR Value DR
SYMBOL njf -6432 -2960 R0
WINDOW 0 695 -72 Left 2
WINDOW 3 712 -60 Left 2
SYMATTR InstName J_A62
SYMATTR Value DR
SYMBOL njf -6576 -2960 R0
WINDOW 0 844 -64 Left 2
WINDOW 3 852 -58 Left 2
SYMATTR InstName J_A63
SYMATTR Value DR
SYMBOL njf -6704 -2960 R0
WINDOW 0 975 -63 Left 2
WINDOW 3 983 -65 Left 2
SYMATTR InstName J_A64
SYMATTR Value DR
SYMBOL njf -6832 -2960 R0
WINDOW 0 1082 -60 Left 2
WINDOW 3 1102 -65 Left 2
SYMATTR InstName J_A65
SYMATTR Value DR
SYMBOL njf -6928 -2960 R0
WINDOW 0 543 -60 Left 2
WINDOW 3 594 -75 Left 2
SYMATTR InstName J_A66
SYMATTR Value DR
SYMBOL njf -7056 -2960 R0
WINDOW 0 695 -72 Left 2
WINDOW 3 712 -60 Left 2
SYMATTR InstName J_A67
SYMATTR Value DR
SYMBOL njf -7200 -2960 R0
WINDOW 0 844 -64 Left 2
WINDOW 3 852 -58 Left 2
SYMATTR InstName J_A68
SYMATTR Value DR
SYMBOL njf -7328 -2960 R0
WINDOW 0 975 -63 Left 2
WINDOW 3 983 -65 Left 2
SYMATTR InstName J_A69
SYMATTR Value DR
SYMBOL njf -7456 -2960 R0
WINDOW 0 1082 -60 Left 2
WINDOW 3 1102 -65 Left 2
SYMATTR InstName J_A70
SYMATTR Value DR
SYMBOL njf -7584 -2960 R0
WINDOW 0 543 -60 Left 2
WINDOW 3 594 -75 Left 2
SYMATTR InstName J_A71
SYMATTR Value DR
SYMBOL njf -7712 -2960 R0
WINDOW 0 695 -72 Left 2
WINDOW 3 712 -60 Left 2
SYMATTR InstName J_A72
SYMATTR Value DR
SYMBOL njf -7856 -2960 R0
WINDOW 0 844 -64 Left 2
WINDOW 3 852 -58 Left 2
SYMATTR InstName J_A73
SYMATTR Value DR
SYMBOL njf -7984 -2960 R0
WINDOW 0 975 -63 Left 2
WINDOW 3 983 -65 Left 2
SYMATTR InstName J_A74
SYMATTR Value DR
SYMBOL njf -8112 -2960 R0
WINDOW 0 1082 -60 Left 2
WINDOW 3 1102 -65 Left 2
SYMATTR InstName J_A75
SYMATTR Value DR
SYMBOL njf -8208 -2960 R0
WINDOW 0 543 -60 Left 2
WINDOW 3 594 -75 Left 2
SYMATTR InstName J_A76
SYMATTR Value DR
SYMBOL njf -8336 -2960 R0
WINDOW 0 695 -72 Left 2
WINDOW 3 712 -60 Left 2
SYMATTR InstName J_A77
SYMATTR Value DR
SYMBOL njf -8480 -2960 R0
WINDOW 0 844 -64 Left 2
WINDOW 3 852 -58 Left 2
SYMATTR InstName J_A78
SYMATTR Value DR
SYMBOL njf -8608 -2960 R0
WINDOW 0 975 -63 Left 2
WINDOW 3 983 -65 Left 2
SYMATTR InstName J_A79
SYMATTR Value DR
SYMBOL njf -8736 -2960 R0
WINDOW 0 1082 -60 Left 2
WINDOW 3 1102 -65 Left 2
SYMATTR InstName J_A80
SYMATTR Value DR
SYMBOL voltage -5056 -6016 R0
WINDOW 0 -135 -1217 VBottom 2
WINDOW 3 222 45 Invisible 2
WINDOW 123 0 0 Left 0
WINDOW 39 0 0 Left 0
SYMATTR InstName V19
SYMATTR Value PULSE(-4 0 10u 0.1u 0.1u 5u 10u 2)
SYMBOL res -4448 -5472 R180
WINDOW 0 -1060 90 Left 2
WINDOW 3 38 61 Left 2
SYMATTR InstName R31
SYMATTR Value 21k
SYMBOL njf -4336 -5552 R0
WINDOW 0 894 8 Left 2
WINDOW 3 941 12 Left 2
SYMATTR InstName J_A30
SYMATTR Value DR
SYMBOL res -4304 -5472 R0
WINDOW 0 830 -72 Left 2
WINDOW 3 -36 60 Left 2
SYMATTR InstName R32
SYMATTR Value 2k
SYMBOL res -4272 -5280 R180
WINDOW 0 -855 272 Left 2
WINDOW 3 36 40 Left 2
SYMATTR InstName R33
SYMATTR Value 2.8k
SYMBOL njf -4512 -5488 R0
WINDOW 0 1111 -157 Left 2
WINDOW 3 1098 -162 Left 2
SYMATTR InstName J_A31
SYMATTR Value DR
SYMBOL voltage -4288 -5568 R270
WINDOW 0 48 34 Left 2
WINDOW 3 53 69 Left 2
WINDOW 123 0 0 Left 0
WINDOW 39 0 0 Left 0
SYMATTR InstName V21
SYMATTR Value 10
SYMBOL voltage -4288 -5312 R0
WINDOW 0 48 34 Left 2
WINDOW 3 53 69 Left 2
WINDOW 123 0 0 Left 0
WINDOW 39 0 0 Left 0
SYMATTR InstName V22
SYMATTR Value -10
SYMBOL res -3840 -5456 R180
WINDOW 0 -1060 90 Left 2
WINDOW 3 38 61 Left 2
SYMATTR InstName R34
SYMATTR Value 21k
SYMBOL njf -3728 -5536 R0
WINDOW 0 894 8 Left 2
WINDOW 3 941 12 Left 2
SYMATTR InstName J_A32
SYMATTR Value DR
SYMBOL res -3696 -5456 R0
WINDOW 0 830 -72 Left 2
WINDOW 3 -36 60 Left 2
SYMATTR InstName R35
SYMATTR Value 1.5k
SYMBOL res -3664 -5264 R180
WINDOW 0 -855 272 Left 2
WINDOW 3 36 40 Left 2
SYMATTR InstName R36
SYMATTR Value 1.5k
SYMBOL njf -3904 -5472 R0
WINDOW 0 1111 -157 Left 2
WINDOW 3 1098 -162 Left 2
SYMATTR InstName J_A47
SYMATTR Value DR
SYMBOL voltage -3680 -5552 R270
WINDOW 0 48 34 Left 2
WINDOW 3 53 69 Left 2
WINDOW 123 0 0 Left 0
WINDOW 39 0 0 Left 0
SYMATTR InstName V24
SYMATTR Value 28
SYMBOL voltage -3680 -5296 R0
WINDOW 0 48 34 Left 2
WINDOW 3 53 69 Left 2
WINDOW 123 0 0 Left 0
WINDOW 39 0 0 Left 0
SYMATTR InstName V25
SYMATTR Value -7
SYMBOL voltage -4928 -6000 R0
WINDOW 0 -135 -1217 VBottom 2
WINDOW 3 222 45 Invisible 2
WINDOW 123 0 0 Left 0
WINDOW 39 0 0 Left 0
SYMATTR InstName V10
SYMATTR Value PULSE(-4 0 10u 10n 10n 0.5u 1u 2)
SYMBOL res -4480 -4912 R180
WINDOW 0 -1060 90 Left 2
WINDOW 3 38 61 Left 2
SYMATTR InstName R16
SYMATTR Value 21k
SYMBOL njf -4368 -4992 R0
WINDOW 0 894 8 Left 2
WINDOW 3 941 12 Left 2
SYMATTR InstName J_A26
SYMATTR Value DR
SYMBOL res -4336 -4912 R0
WINDOW 0 830 -72 Left 2
WINDOW 3 -36 60 Left 2
SYMATTR InstName R17
SYMATTR Value 2k
SYMBOL res -4304 -4720 R180
WINDOW 0 -855 272 Left 2
WINDOW 3 36 40 Left 2
SYMATTR InstName R18
SYMATTR Value 2.8k
SYMBOL njf -4544 -4928 R0
WINDOW 0 1111 -157 Left 2
WINDOW 3 1098 -162 Left 2
SYMATTR InstName J_A27
SYMATTR Value DR
SYMBOL voltage -4320 -5008 R270
WINDOW 0 48 34 Left 2
WINDOW 3 53 69 Left 2
WINDOW 123 0 0 Left 0
WINDOW 39 0 0 Left 0
SYMATTR InstName V12
SYMATTR Value 10
SYMBOL voltage -4320 -4752 R0
WINDOW 0 48 34 Left 2
WINDOW 3 53 69 Left 2
WINDOW 123 0 0 Left 0
WINDOW 39 0 0 Left 0
SYMATTR InstName V14
SYMATTR Value -10
SYMBOL res -3872 -4896 R180
WINDOW 0 -1060 90 Left 2
WINDOW 3 38 61 Left 2
SYMATTR InstName R22
SYMATTR Value 21k
SYMBOL njf -3760 -4976 R0
WINDOW 0 894 8 Left 2
WINDOW 3 941 12 Left 2
SYMATTR InstName J_A28
SYMATTR Value DR
SYMBOL res -3728 -4896 R0
WINDOW 0 830 -72 Left 2
WINDOW 3 -36 60 Left 2
SYMATTR InstName R23
SYMATTR Value 1.5k
SYMBOL res -3696 -4704 R180
WINDOW 0 -855 272 Left 2
WINDOW 3 36 40 Left 2
SYMATTR InstName R24
SYMATTR Value 1.5k
SYMBOL njf -3936 -4912 R0
WINDOW 0 1111 -157 Left 2
WINDOW 3 1098 -162 Left 2
SYMATTR InstName J_A29
SYMATTR Value DR
SYMBOL voltage -3712 -4992 R270
WINDOW 0 48 34 Left 2
WINDOW 3 53 69 Left 2
WINDOW 123 0 0 Left 0
WINDOW 39 0 0 Left 0
SYMATTR InstName V15
SYMATTR Value 28
SYMBOL voltage -3712 -4736 R0
WINDOW 0 48 34 Left 2
WINDOW 3 53 69 Left 2
WINDOW 123 0 0 Left 0
WINDOW 39 0 0 Left 0
SYMATTR InstName V16
SYMATTR Value -7
SYMBOL res -3536 -4848 R180
WINDOW 0 -1060 90 Left 2
WINDOW 3 38 61 Left 2
SYMATTR InstName R37
SYMATTR Value 21k
SYMBOL njf -3424 -4928 R0
WINDOW 0 894 8 Left 2
WINDOW 3 941 12 Left 2
SYMATTR InstName J_A48
SYMATTR Value DR
SYMBOL res -3392 -4848 R0
WINDOW 0 830 -72 Left 2
WINDOW 3 -36 60 Left 2
SYMATTR InstName R38
SYMATTR Value 1.5k
SYMBOL res -3360 -4656 R180
WINDOW 0 -855 272 Left 2
WINDOW 3 36 40 Left 2
SYMATTR InstName R39
SYMATTR Value 1.5k
SYMBOL njf -3600 -4864 R0
WINDOW 0 1111 -157 Left 2
WINDOW 3 1098 -162 Left 2
SYMATTR InstName J_A49
SYMATTR Value DR
SYMBOL voltage -3376 -4944 R270
WINDOW 0 48 34 Left 2
WINDOW 3 53 69 Left 2
WINDOW 123 0 0 Left 0
WINDOW 39 0 0 Left 0
SYMATTR InstName V18
SYMATTR Value 28
SYMBOL voltage -3376 -4688 R0
WINDOW 0 48 34 Left 2
WINDOW 3 53 69 Left 2
WINDOW 123 0 0 Left 0
WINDOW 39 0 0 Left 0
SYMATTR InstName V20
SYMATTR Value -7
SYMBOL res -4848 -5472 R180
WINDOW 0 -1060 90 Left 2
WINDOW 3 38 61 Left 2
SYMATTR InstName R40
SYMATTR Value 20k
SYMBOL njf -4736 -5552 R0
WINDOW 0 894 8 Left 2
WINDOW 3 941 12 Left 2
SYMATTR InstName J_A50
SYMATTR Value DR
SYMBOL res -4704 -5472 R0
WINDOW 0 830 -72 Left 2
WINDOW 3 -36 60 Left 2
SYMATTR InstName R41
SYMATTR Value 2k
SYMBOL res -4672 -5280 R180
WINDOW 0 -855 272 Left 2
WINDOW 3 36 40 Left 2
SYMATTR InstName R42
SYMATTR Value 2.8k
SYMBOL njf -4912 -5488 R0
WINDOW 0 1111 -157 Left 2
WINDOW 3 1098 -162 Left 2
SYMATTR InstName J_A51
SYMATTR Value DR
SYMBOL voltage -4688 -5568 R270
WINDOW 0 48 34 Left 2
WINDOW 3 53 69 Left 2
WINDOW 123 0 0 Left 0
WINDOW 39 0 0 Left 0
SYMATTR InstName V23
SYMATTR Value 10
SYMBOL voltage -4688 -5312 R0
WINDOW 0 48 34 Left 2
WINDOW 3 53 69 Left 2
WINDOW 123 0 0 Left 0
WINDOW 39 0 0 Left 0
SYMATTR InstName V26
SYMATTR Value -10
SYMBOL res -2160 -5408 R180
WINDOW 0 -1060 90 Left 2
WINDOW 3 38 61 Left 2
SYMATTR InstName R43
SYMATTR Value 10k
SYMBOL njf -2048 -5488 R0
WINDOW 0 894 8 Left 2
WINDOW 3 941 12 Left 2
SYMATTR InstName J_A52
SYMATTR Value DR
SYMBOL res -2016 -5408 R0
WINDOW 0 830 -72 Left 2
WINDOW 3 -36 60 Left 2
SYMATTR InstName R44
SYMATTR Value 2k
SYMBOL res -1984 -5216 R180
WINDOW 0 -855 272 Left 2
WINDOW 3 36 40 Left 2
SYMATTR InstName R45
SYMATTR Value 2.8k
SYMBOL njf -2224 -5424 R0
WINDOW 0 1111 -157 Left 2
WINDOW 3 1098 -162 Left 2
SYMATTR InstName J_A53
SYMATTR Value DR
SYMBOL voltage -2000 -5504 R270
WINDOW 0 48 34 Left 2
WINDOW 3 53 69 Left 2
WINDOW 123 0 0 Left 0
WINDOW 39 0 0 Left 0
SYMATTR InstName V27
SYMATTR Value 10
SYMBOL voltage -2000 -5248 R0
WINDOW 0 48 34 Left 2
WINDOW 3 53 69 Left 2
WINDOW 123 0 0 Left 0
WINDOW 39 0 0 Left 0
SYMATTR InstName V28
SYMATTR Value -10
SYMBOL res -1488 -5360 R180
WINDOW 0 -1060 90 Left 2
WINDOW 3 38 61 Left 2
SYMATTR InstName R46
SYMATTR Value 10k
SYMBOL njf -1376 -5440 R0
WINDOW 0 894 8 Left 2
WINDOW 3 941 12 Left 2
SYMATTR InstName J_A54
SYMATTR Value DR
SYMBOL res -1344 -5360 R0
WINDOW 0 830 -72 Left 2
WINDOW 3 -36 60 Left 2
SYMATTR InstName R47
SYMATTR Value 2k
SYMBOL res -1312 -5168 R180
WINDOW 0 -855 272 Left 2
WINDOW 3 36 40 Left 2
SYMATTR InstName R48
SYMATTR Value 2.8k
SYMBOL njf -1552 -5376 R0
WINDOW 0 1111 -157 Left 2
WINDOW 3 1098 -162 Left 2
SYMATTR InstName J_A55
SYMATTR Value DR
SYMBOL voltage -1328 -5456 R270
WINDOW 0 48 34 Left 2
WINDOW 3 53 69 Left 2
WINDOW 123 0 0 Left 0
WINDOW 39 0 0 Left 0
SYMATTR InstName V29
SYMATTR Value 10
SYMBOL voltage -1328 -5200 R0
WINDOW 0 48 34 Left 2
WINDOW 3 53 69 Left 2
WINDOW 123 0 0 Left 0
WINDOW 39 0 0 Left 0
SYMATTR InstName V30
SYMATTR Value -10
SYMBOL njf -1552 -5280 R0
WINDOW 0 1111 -157 Left 2
WINDOW 3 1098 -162 Left 2
SYMATTR InstName J_A56
SYMATTR Value DR
SYMBOL voltage -5168 -6016 R0
WINDOW 0 -135 -1217 VBottom 2
WINDOW 3 222 45 Invisible 2
WINDOW 123 0 0 Left 0
WINDOW 39 0 0 Left 0
SYMATTR InstName V31
SYMATTR Value PULSE(-4 0 15u 0.1u 0.1u 10u 20u 1)
SYMBOL res -1456 -4816 R180
WINDOW 0 -1060 90 Left 2
WINDOW 3 38 61 Left 2
SYMATTR InstName R49
SYMATTR Value 86.6k
SYMBOL njf -1344 -4896 R0
WINDOW 0 894 8 Left 2
WINDOW 3 941 12 Left 2
SYMATTR InstName J_A57
SYMATTR Value DR
SYMBOL res -1312 -4816 R0
WINDOW 0 830 -72 Left 2
WINDOW 3 -36 60 Left 2
SYMATTR InstName R50
SYMATTR Value 1.65k
SYMBOL res -1280 -4624 R180
WINDOW 0 -855 272 Left 2
WINDOW 3 36 40 Left 2
SYMATTR InstName R51
SYMATTR Value 2.74k
SYMBOL njf -1520 -4832 R0
WINDOW 0 1111 -157 Left 2
WINDOW 3 1098 -162 Left 2
SYMATTR InstName J_A58
SYMATTR Value DR
SYMBOL njf -1408 -4832 R0
WINDOW 0 1111 -157 Left 2
WINDOW 3 1098 -162 Left 2
SYMATTR InstName J_A81
SYMATTR Value DR
SYMBOL res -992 -4816 R180
WINDOW 0 -1060 90 Left 2
WINDOW 3 38 61 Left 2
SYMATTR InstName R52
SYMATTR Value 30.9k
SYMBOL njf -880 -4896 R0
WINDOW 0 894 8 Left 2
WINDOW 3 941 12 Left 2
SYMATTR InstName J_A82
SYMATTR Value DR
SYMBOL res -848 -4816 R0
WINDOW 0 830 -72 Left 2
WINDOW 3 -36 60 Left 2
SYMATTR InstName R53
SYMATTR Value 1.58k
SYMBOL res -816 -4624 R180
WINDOW 0 -855 272 Left 2
WINDOW 3 36 40 Left 2
SYMATTR InstName R54
SYMATTR Value 2.61k
SYMBOL njf -1056 -4832 R0
WINDOW 0 1111 -157 Left 2
WINDOW 3 1098 -162 Left 2
SYMATTR InstName J_A83
SYMATTR Value DR
SYMBOL njf -944 -4832 R0
WINDOW 0 1111 -157 Left 2
WINDOW 3 1098 -162 Left 2
SYMATTR InstName J_A84
SYMATTR Value DR
SYMBOL voltage -4592 -5968 R270
WINDOW 0 48 34 Left 2
WINDOW 3 53 69 Left 2
WINDOW 123 0 0 Left 0
WINDOW 39 0 0 Left 0
SYMATTR InstName V32
SYMATTR Value 10
SYMBOL voltage -4352 -5968 R0
WINDOW 0 48 34 Left 2
WINDOW 3 53 69 Left 2
WINDOW 123 0 0 Left 0
WINDOW 39 0 0 Left 0
SYMATTR InstName V33
SYMATTR Value -10
TEXT -6184 -5680 Left 2 !.tran 0 40us 1ps 0.01
TEXT -6176 -6200 Left 7 ;System Parameters
TEXT -6184 -5744 Left 2 !.model DR NJF(Beta=0.135m Betatce=-0.5 Vto=-3.45 Vtotc=-2.5m Lambda=0.005 Is=205.2f Xti=3 Isr=1988f Nr=4 Alpha=20.98u N=3 Rd=1 Rs=1 Cgd=16.9p Cgs=16.9p Fc=0.5 Vk=123.7 M=407m Pb=1 Kf=37860f Af=1 Mfg=Linear_Systems)
TEXT -6184 -5712 Left 2 !.options NoOpIter

The netlist it stands for:
* Multi-Or.asc
V5 VDD 0 24
V6 VSS 0 -20
V17 N010 0 PULSE(-4 0 10u 0.1u 0.1u 5u 10u 2)
R28 N005 VDD 50k
J_A35 VDD N005 P001 DR
R29 P001 1 1k
R30 VSS 1 4.5k
J_A36 N005 N010 0 DR
V7 CLK 0 PULSE(-3.6 -800m 10u 1ns 1ns 5.15us 10us 10000000000000)
V1 N019 0 PULSE(-4 0 10u 0.1u 0.1u 5u 10u 2)
J_A1 N018 LOW 0 DR
R1 N018 VDD 50k
J_A2 VDD N018 P002 DR
R2 P002 2 1k
R3 VSS 2 4.5k
J_A3 N018 N019 0 DR
V3 LOW 0 -4
V2 N032 0 PULSE(-4 0 10u 0.1u 0.1u 5u 10u 2)
J_A4 N029 LOW 0 DR
R4 N029 VDD 50k
J_A5 VDD N029 P003 DR
R5 P003 3 1k
R6 VSS 3 4.5k
J_A6 N029 N032 0 DR
J_A7 N029 LOW 0 DR
V4 N036 0 PULSE(-4 0 10u 0.1u 0.1u 5u 10u 2)
J_A8 N035 LOW 0 DR
R7 N035 VDD 50k
J_A9 VDD N035 P004 DR
R8 P004 4 1k
R9 VSS 4 4.5k
J_A10 N035 N036 0 DR
J_A11 N035 LOW 0 DR
J_A12 N035 LOW 0 DR
V8 N038 0 PULSE(-4 0 10u 0.1u 0.1u 5u 10u 2)
J_A13 N037 LOW 0 DR
R10 N037 VDD 50k
J_A14 VDD N037 P005 DR
R11 P005 5 1k
R12 VSS 5 4.5k
J_A15 N037 N038 0 DR
J_A16 N037 LOW 0 DR
J_A17 N037 LOW 0 DR
J_A18 N037 LOW 0 DR
V9 N040 0 PULSE(-4 0 10u 0.1u 0.1u 5u 10u 2)
J_A19 N039 LOW 0 DR
R13 N039 VDD 50k
J_A20 VDD N039 P006 DR
R14 P006 6 1k
R15 VSS 6 4.5k
J_A21 N039 N040 0 DR
J_A22 N039 LOW 0 DR
J_A23 N039 LOW 0 DR
J_A24 N039 LOW 0 DR
J_A25 N039 LOW 0 DR
V11 N042 0 PULSE(-4 0 10u 0.1u 0.1u 5u 10u 2)
J_A33 N041 LOW 0 DR
R19 N041 VDD 50k
J_A34 VDD N041 P007 DR
R20 P007 11 1k
R21 VSS 11 4.5k
J_A37 N041 N042 0 DR
J_A38 N041 LOW 0 DR
J_A39 N041 LOW 0 DR
J_A40 N041 LOW 0 DR
J_A41 N041 LOW 0 DR
J_A42 N041 LOW 0 DR
J_A43 N041 LOW 0 DR
J_A44 N041 LOW 0 DR
J_A45 N041 LOW 0 DR
J_A46 N041 LOW 0 DR
V13 N044 0 PULSE(-4 0 10u 0.1u 0.1u 5u 10u 2)
J_A59 N043 LOW 0 DR
R25 N043 VDD 50k
J_A60 VDD N043 P008 DR
R26 P008 21 1k
R27 VSS 21 4.5k
J_A61 N043 N044 0 DR
J_A62 N043 LOW 0 DR
J_A63 N043 LOW 0 DR
J_A64 N043 LOW 0 DR
J_A65 N043 LOW 0 DR
J_A66 N043 LOW 0 DR
J_A67 N043 LOW 0 DR
J_A68 N043 LOW 0 DR
J_A69 N043 LOW 0 DR
J_A70 N043 LOW 0 DR
J_A71 N043 LOW 0 DR
J_A72 N043 LOW 0 DR
J_A73 N043 LOW 0 DR
J_A74 N043 LOW 0 DR
J_A75 N043 LOW 0 DR
J_A76 N043 LOW 0 DR
J_A77 N043 LOW 0 DR
J_A78 N043 LOW 0 DR
J_A79 N043 LOW 0 DR
J_A80 N043 LOW 0 DR
V19 100k 0 PULSE(-4 0 10u 0.1u 0.1u 5u 10u 2)
R31 N007 N002 21k
J_A30 N002 N007 P009 DR
R32 P009 N013 2k
R33 P010 N013 2.8k
J_A31 N007 100k 0 DR
V21 N002 0 10
V22 P010 0 -10
R34 N008 N003 21k
J_A32 N003 N008 P011 DR
R35 P011 N015 1.5k
R36 P012 N015 1.5k
J_A47 N008 100k 0 DR
V24 N003 0 28
V25 P012 0 -7
V10 1M 0 PULSE(-4 0 10u 10n 10n 0.5u 1u 2)
R16 N023 N020 21k
J_A26 N020 N023 P013 DR
R17 P013 N028 2k
R18 P014 N028 2.8k
J_A27 N023 1M 0 DR
V12 N020 0 10
V14 P014 0 -10
R22 N024 N021 21k
J_A28 N021 N024 P015 DR
R23 P015 N030 1.5k
R24 P016 N030 1.5k
J_A29 N024 1M 0 DR
V15 N021 0 28
V16 P016 0 -7
R37 N025 N022 21k
J_A48 N022 N025 P017 DR
R38 P017 N031 1.5k
R39 P018 N031 1.5k
J_A49 N025 N030 0 DR
V18 N022 0 28
V20 P018 0 -7
R40 N006 N001 20k
J_A50 N001 N006 P019 DR
R41 P019 N012 2k
R42 P020 N012 2.8k
J_A51 N006 100k 0 DR
V23 N001 0 10
V26 P020 0 -10
R43 N011 N004 10k
J_A52 N004 N011 P021 DR
R44 P021 N016 2k
R45 P022 N016 2.8k
J_A53 N011 100k 0 DR
V27 N004 0 10
V28 P022 0 -10
R46 N014 N009 10k
J_A54 N009 N014 P023 DR
R47 P023 N017 2k
R48 P024 N017 2.8k
J_A55 N014 100k P025 DR
V29 N009 0 10
V30 P024 0 -10
J_A56 P025 50k 0 DR
V31 50k 0 PULSE(-4 0 15u 0.1u 0.1u 10u 20u 1)
R49 N026 10v 86.6k
J_A57 10v N026 P026 DR
R50 P026 N033 1.65k
R51 -10v N033 2.74k
J_A58 N026 100k 0 DR
J_A81 N026 50k 0 DR
R52 N027 10v 30.9k
J_A82 10v N027 P027 DR
R53 P027 N034 1.58k
R54 -10v N034 2.61k
J_A83 N027 100k 0 DR
J_A84 N027 50k 0 DR
V32 10v 0 10
V33 -10v 0 -10
.model NJF NJF
.model PJF PJF
.lib standard.jft
.tran 0 40us 1ps 0.01
* System Parameters
.model DR NJF(Beta=0.135m Betatce=-0.5 Vto=-3.45 Vtotc=-2.5m Lambda=0.005 Is=205.2f Xti=3 Isr=1988f Nr=4 Alpha=20.98u N=3 Rd=1 Rs=1 Cgd=16.9p Cgs=16.9p Fc=0.5 Vk=123.7 M=407m Pb=1 Kf=37860f Af=1 Mfg=Linear_Systems)
.options NoOpIter
.backanno
.end